# EAGLE design Charger (EAGLE 6.4)
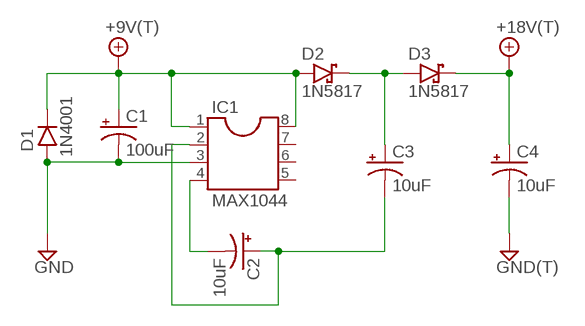
[diagram p0: schematic, sheet 1]

## Parts
+9V  +9V(T)  [SQUARE]
+18V  +18V(T)  [SQUARE]
C1  100uF  0801  [080_035_1]
C2  10uF  0501  [050_020_1]
C3  10uF  0501  [050_020_1]
C4  10uF  0501  [050_020_1]
D1  1N4001  1N400X.3  [DO41-3]
D2  1N5817  [DO41-3]
D3  1N5817  [DO41-3]
GND  GND(T)  [SQUARE]
IC1  MAX1044  [DIL08]

## Nets
+9V: +9V.1(+9V) C1.+ D1.C D2.A IC1.1 IC1.8
+18V: +18V.1(+18V) C4.+ D3.C
GND: C1.- C4.- D1.A GND.1(GND) IC1.3
N$2: C2.- IC1.4
N$3: C2.+ C3.- IC1.2
N$4: C3.+ D2.C D3.A
Unconnected: IC1.5 IC1.6 IC1.7

## Library data of the parts
+9V = mb_supply:+9V(T): +9V Voltage Supply use this to hook up +9v throughout a schematic instead of running wire automatically labels the net "+9v" adds a hookup pad to the circuit board
+18V = mb_supply:+18V(T): +18V Voltage Supply use this to hook up +18V throughout a schematic instead of running wire automatically labels the net "+18V" adds a hookup pad to the circuit board
C1 = mb_caps-electro:080: 47 - 470uF Xicon values at Mouser.com 10V: 330, 470uF; 16V: 220, 330uF; 25V: 220uF; 50V: 47, 100uF
C2-C4 = mb_caps-electro:050: 0.22 - 100uF Xicon values at Mouser.com: 10V: 10 - 100uF; 16V: 2.2 - 47uF; 25V: 0.47 - 47uF; 50V: 0.22 - 22uF
D1 = mb_diodes:1N400X: Rectifier Diodes often used in power supply to prevent damage from reverse polarization
D2 D3 = mb_diodes:1N5817
GND = mb_supply:GND(T): Ground use this to hook up ground (GND) throughout a schematic instead of running wire automatically labels the net "GND" adds a hookup pad to the circuit board (you can use several)
IC1 = mb_ics:MAX1044

## Board
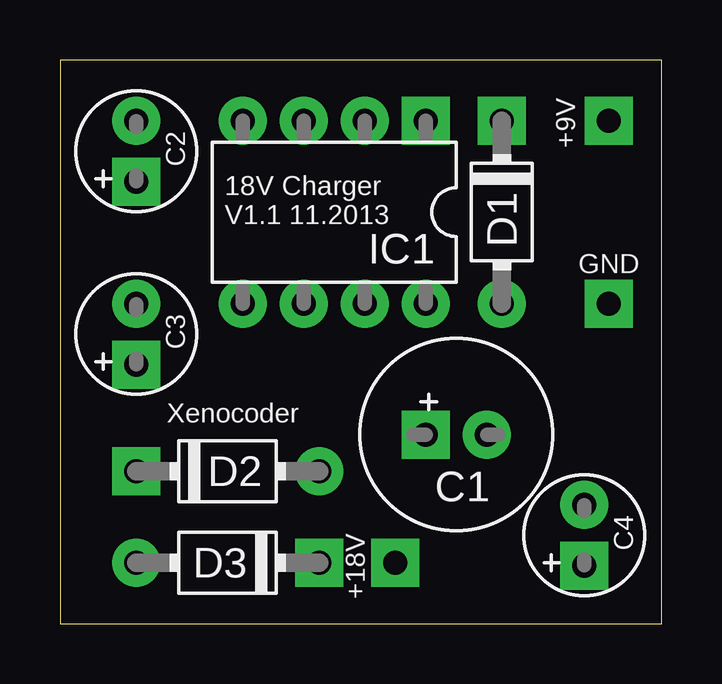
[diagram p1: board, top side]
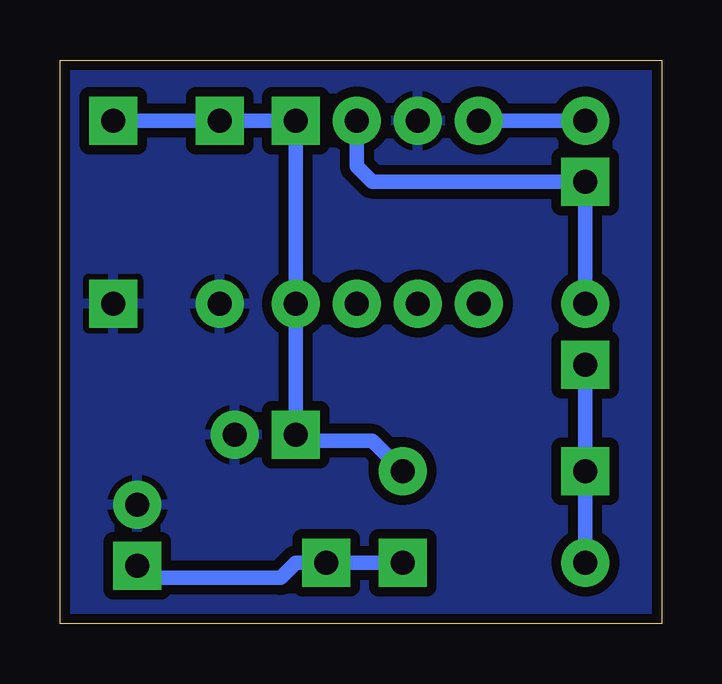
[diagram p2: board, bottom side, seen from below]

Size 25.07 x 23.48 mm. Coordinates in mm from the lower left corner, seen from the top.
Outline: 0,0 25.07,0 25.07,23.48 0,23.48 0,0
Copper layers (1*16): Top 0.0356mm / dielectric 1.5011mm / Bottom 0.0356mm
Design rules "LaenPCBOrder": minimum track width 6mil, minimum drill 13mil, track to track 6mil, track to pad 6mil, pad to pad 6mil, via to via 6mil, smd to smd 6mil, copper to edge 15mil, drill to drill 6mil, minimum pad ring 7mil, minimum via ring 7mil, stop-mask expansion 3mil, vias tented up to drill 0mil, thermal gap 10mil

### Footprints (pad centres in the part's own frame; a part is rotated, then mirrored left to right if it is on the bottom)
SQUARE = drill 1 pad 2 square: 1 0,0
080_035_1 = drill 1 pad 2 square: + -1.27,0 | drill 1 pad 2: - 1.27,0
050_020_1 = drill 1 pad 2 square: + -1.27,0 | drill 1 pad 2: - 1.27,0
DO41-3 = drill 1 pad 2: A 3.81,0 | drill 1 pad 2 square: C -3.81,0
DIL08 = drill 1 pad 2 square: 1 -3.81,-3.81 | drill 1 pad 2: 2 -1.27,-3.81; 3 1.27,-3.81; 4 3.81,-3.81; 5 3.81,3.81; 6 1.27,3.81; 7 -1.27,3.81; 8 -3.81,3.81

### Placement (x,y rotation side)
+9V  22.86,20.95 0 top
+18V  13.97,2.54 0 top
C1  16.51,7.87 0 top
C2  3.17,19.68 90 top
C3  3.17,12.06 90 top
C4  21.84,3.68 90 top
D1  18.41,17.14 270 top
D2  6.99,6.35 0 top
D3  6.99,2.54 180 top
GND  22.86,13.34 0 top
IC1  11.43,17.14 180 top

### Tracks (layer width: path | path; a pad name or v marks a point on that pad's centre or on a via)
+9V
  Bottom 0.61: D2.A 12.06,7.62 14.99,7.62 C1.+ IC1.8 IC1.1 D1.C +9V.1
+18V
  Bottom 0.61: D3.C +18V.1 15.24,2.54 15.88,1.91 21.34,1.91 C4.+
GND
  pour Bottom (isolate 0.406): 0,23.5 25.27,23.5 25.27,0 0,0
N$2
  Bottom 0.61: C2.- IC1.4
N$3
  Bottom 0.61: IC1.2 12.7,19.05 12.06,18.41 C2.+ C3.-
N$4
  Bottom 0.61: C3.+ D2.C D3.A

### Text on the board
tPlace: 18V Charger / V1.1 11.2013 | Xenocoder